# EAGLE design BBiQ-1.0 (EAGLE 9.1.1)
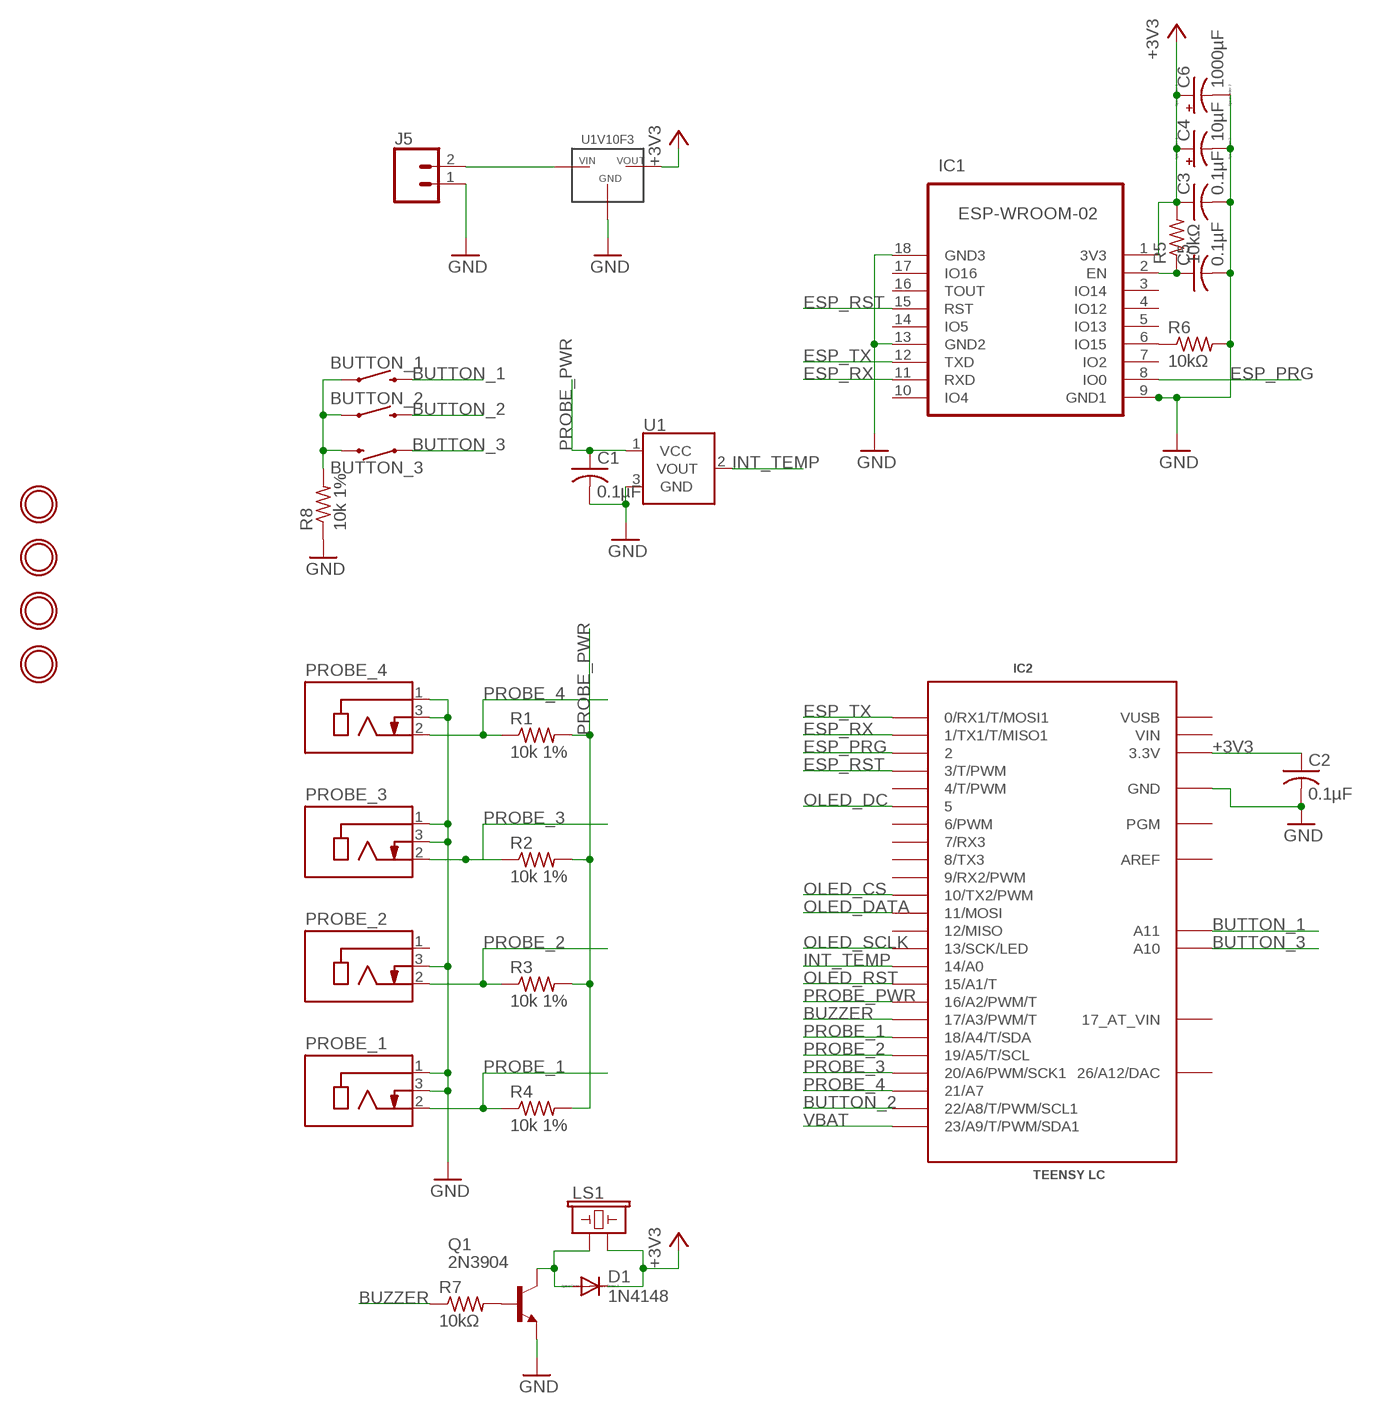
[diagram p0: schematic, sheet 1]

## Parts
BUTTON_1  MOMENTARY-SWITCH-SPST-PTH-6.0MM  [TACTILE_SWITCH_PTH_6.0MM]
BUTTON_2  MOMENTARY-SWITCH-SPST-PTH-6.0MM  [TACTILE_SWITCH_PTH_6.0MM]
BUTTON_3  MOMENTARY-SWITCH-SPST-PTH-6.0MM  [TACTILE_SWITCH_PTH_6.0MM]
C1  0.1µF  C-US025-025X050  [C025-025X050]
C2  0.1µF  C-US025-025X050  [C025-025X050]
C3  0.1µF  C-US025-025X050  [C025-025X050]
C4  10µF  CPOL-USE2-5  [E2-5]
C5  0.1µF  C-US025-025X050  [C025-025X050]
C6  1000µF  CPOL-USE3.5-8  [E3,5-8]
D1  1N4148  1N4148DO35-7  [DO35-7]
IC1  ESP-WROOM-02  [ESP-WROOM-02]
IC2  TEENSY LC  TEENSY_LC_ALL_PINS  [TEENSY_3.0-3.2&LC_ALL_PINS]
J5  CONN_02JST-PTH-2  [JST-2-PTH]
LS1  BUZZER-PTH  [BUZZER-12MM]
PROBE_1  MJ-2506N  [CUI_MJ-2506N]
PROBE_2  MJ-2506N  [CUI_MJ-2506N]
PROBE_3  MJ-2506N  [CUI_MJ-2506N]
PROBE_4  MJ-2506N  [CUI_MJ-2506N]
Q1  2N3904  [TO92]
R1  10k 1%  R-US_0207/7  [0207/7]
R2  10k 1%  R-US_0207/7  [0207/7]
R3  10k 1%  R-US_0207/7  [0207/7]
R4  10k 1%  R-US_0207/7  [0207/7]
R5  10kΩ  R-US_0207/7  [0207/7]
R6  10kΩ  R-US_0207/7  [0207/7]
R7  10kΩ  R-US_0207/7  [0207/7]
R8  10k 1%  R-US_0207/7  [0207/7]
U1  TMP36GT9  [TO-92]
U$2  U1V10F3  [U1V10F3]
U$3  MOUNTINGHOLE2.5  [MOUNTINGHOLE_2.5_PLATED]
U$4  MOUNTINGHOLE2.5  [MOUNTINGHOLE_2.5_PLATED]
U$5  MOUNTINGHOLE2.5  [MOUNTINGHOLE_2.5_PLATED]
U$6  MOUNTINGHOLE2.5  [MOUNTINGHOLE_2.5_PLATED]

## Nets
+3V3: C2.1 C3.1 C4.+ C6.+ D1.C IC1.1(3V3) IC2.3.3V IC2.3.3V1(3.3V) LS1.- R5.2 U$2.VOUT
BUTTON_1: BUTTON_1.3 IC2.A11
BUTTON_2: BUTTON_2.3 IC2.22/A8(22/A8/T/PWM/SCL1)
BUTTON_3: BUTTON_3.1 IC2.A10
BUZZER: IC2.17/A3(17/A3/PWM/T) R7.1
ESP_EN: C5.1 IC1.2(EN) R5.1
ESP_PRG: IC1.8(IO0) IC2.2
ESP_RST: IC1.15(RST) IC2.3(3/T/PWM)
ESP_RX: IC1.11(RXD) IC2.1(1/TX1/T/MISO1)
ESP_TX: IC1.12(TXD) IC2.0(0/RX1/T/MOSI1)
GND: C1.2 C2.2 C3.2 C4.- C5.2 C6.- IC1.9(GND1) IC1.13(GND2) IC1.18(GND3) IC1.19(GND0) IC2.AGND(GND) IC2.GND IC2.GND1(GND) J5.1 PROBE_1.1 PROBE_1.3 PROBE_2.3 PROBE_3.1 PROBE_3.3 PROBE_4.1 PROBE_4.3 Q1.3(E) R6.2 R8.1 U1.3(GND) U$2.GND
INT_TEMP: IC2.14/A0 U1.2(VOUT)
N$1: IC1.6(IO15) R6.1
N$2: Q1.2(B) R7.2
N$3: D1.A LS1.+ Q1.1(C)
N$4: BUTTON_1.1 BUTTON_2.1 BUTTON_3.3 R8.2
OLED_CS: IC2.10(10/TX2/PWM)
OLED_DATA: IC2.11(11/MOSI)
OLED_DC: IC2.5
OLED_RST: IC2.15/A1(15/A1/T)
OLED_SCLK: IC2.13(13/SCK/LED)
PROBE_1: IC2.18/A4(18/A4/T/SDA) PROBE_1.2 R4.1
PROBE_2: IC2.19/A5(19/A5/T/SCL) PROBE_2.2 R3.1
PROBE_3: IC2.20/A6(20/A6/PWM/SCK1) PROBE_3.2 R2.1
PROBE_4: IC2.21/A7 PROBE_4.2 R1.1
PROBE_PWR: C1.1 IC2.16/A2(16/A2/PWM/T) R1.2 R2.2 R3.2 R4.2 U1.1(VCC)
VBAT: IC2.23/A9(23/A9/T/PWM/SDA1) J5.2 U$2.VIN
Unconnected: IC1.3(IO14) IC1.4(IO12) IC1.5(IO13) IC1.7(IO2) IC1.10(IO4) IC1.14(IO5) IC1.16(TOUT) IC1.17(IO16) IC2.4(4/T/PWM) IC2.6(6/PWM) IC2.7(7/RX3) IC2.8(8/TX3) IC2.9(9/RX2/PWM) IC2.12(12/MISO) IC2.PGM IC2.VBAT(17_AT_VIN) PROBE_2.1

## Power pins joined to a net without a drawn wire
26/A12/DAC: IC2.RESET/DAC(26/A12/DAC)
AREF: IC2.AREF
VIN: IC2.VIN
VUSB: IC2.VUSB

## Library data of the parts
BUTTON_1-BUTTON_3 = SparkFun-Switches:MOMENTARY-SWITCH-SPST: Momentary Switch (Pushbutton) - SPST Normally-open (NO) SPST momentary switches (buttons, pushbuttons). Variants PTH-12MM - 12mm square, through-hole Momentary Pushbutton Switch - 12mm Square <https://www.sparkfun.com/products/9190> (COM-09190) PTH-6.0MM, PTH-6.0MM-KIT - 6.0mm square, through-hole Mini Pushbutton Switch <https://www.sparkfun.com/products/97> (COM-00097) KIT package intended for soldering kit's - only one side of pads' copper is exposed. PTH-RIGHT-ANGLE-KIT - Right-angle, through-hole Right Angle Tactile Button <https://www.sparkfun.com/products/10791> - Used on SparkFun BigTime Watch Kit <https://www.sparkfun.com/products/11734> SMD-12MM - 12mm square, surface-mount Tactile Button - SMD (12mm) <https://www.sparkfun.com/products/12993> (COM-12993) Used on SparkFun PicoBoard <https://www.sparkfun.com/products/11888> SMD-4.5MM - 4.5mm Square Trackball Switch Used on SparkFun Blackberry Trackballer Breakout <https://www.sparkfun.com/products/13169> SMD-4.6MMX2.8MM - 4.60mm x 2.80mm, surface mount Used on SparkFun SAMD21 Mini Breakout <https://www.sparkfun.com/products/13664> SMD-5.2MM, SMD-5.2-REDUNDANT - 5.2mm square, surface-mount Mini Pushbutton Switch - SMD <https://www.sparkfun.com/products/8720> (COM-08720) Used on Arduino Pro Mini <https://www.sparkfun.com/products/11114> REDUNDANT package connects both switch circuits together SMD-6.0X3.5MM - 6.0 x 3.5mm, surface mount Momentary Reset Switch SMD <https://www.sparkfun.com/products/8229> (COM-08229) SMD-6.2MM-TALL - 6.2mm square, surface mount Tactile Button - SMD (6mm) <https://www.sparkfun.com/products/12992> Used on SparkFun Digital Sandbox <https://www.sparkfun.com/products/12651> SMD-RIGHT-ANGLE - Right-angle, surface mount Used on SparkFun Block for Intel® Edison - Arduino <https://www.sparkfun.com/products/13036>; PROD_ID: SWCH-08441; SF_SKU: COM-00097
C1-C3 C5 = resistor:C-US: CAPACITOR, American symbol
C4 C6 = resistor:CPOL-US: POLARIZED CAPACITOR, American symbol
D1 = diode:1N4148: DIODE high speed (Philips)
IC1 = esp-wroom-02:ESP-WROOM-02: WiFi module - ESP-WROOM-02
IC2 = Teensy_3_and_LC_Series_Boards_v1.4:TEENSY_LC_ALL_PINS: Teensy LC board with all pins used.
J5 = SparkFun-Connectors:CONN_02: Multi connection point. Often used as Generic Header-pin footprint for 0.1 inch spaced/style header connections On any of the 0.1 inch spaced packages, you can populate with these: Break Away Headers - Straight <https://www.sparkfun.com/products/116> (PRT-00116) Break Away Male Headers - Right Angle <https://www.sparkfun.com/products/553> (PRT-00553) Female Headers <https://www.sparkfun.com/products/115> (PRT-00115) Break Away Headers - Machine Pin <https://www.sparkfun.com/products/117> (PRT-00117) Break Away Female Headers - Swiss Machine Pin <https://www.sparkfun.com/products/743> (PRT-00743) For SCREWTERMINALS and SPRING TERMINALS visit here: Screw Terimnals on SparkFun.com <https://www.sparkfun.com/search/results?term=Screw+Terminals> (5mm/3.5mm/2.54mm spacing) This device is also useful as a general connection point to wire up your design to another part of your project. Our various solder wires solder well into these plated through hole pads. Hook-Up Wire - Assortment (Stranded, 22 AWG) <https://www.sparkfun.com/products/11375> (PRT-11375) Hook-Up Wire - Assortment (Solid Core, 22 AWG) <https://www.sparkfun.com/products/11367> (PRT-11367) View the entire wire category on our website here <https://www.sparkfun.com/categories/141> Special notes: Molex polarized connector foot print use with: PRT-08233 with associated crimp pins and housings. 2.54_SCREWTERM for use with PRT-10571. 3.5mm Screw Terminal footprints for PRT-08084 5mm Screw Terminal footprints for use with PRT-08432; PROD_ID: CONN-09863; SKU: PRT-09914
LS1 = SparkFun-Electromechanical:BUZZER: Buzzer Small round buzzers that operate around the audible 2kHz range. You can use these as speakers to create simple music or user interfaces. Variant Overview: PTH - Mini Speaker - PC Mount 12mm 2.048kHz <https://www.sparkfun.com/products/7950> PTH_KIT - Mini Speaker - PC Mount 12mm 2.048kHz <https://www.sparkfun.com/products/7950> KIT simplifies soldering by adding stop mask to one side of the pads. PTH_NO_SILK - Mini Speaker - PC Mount 12mm 2.048kHz <https://www.sparkfun.com/products/7950> No silkscreen indicator of buzzer outline. PTH_KIT_NO_SILK - Mini Speaker - PC Mount 12mm 2.048kHz <https://www.sparkfun.com/products/7950> KIT package w/o silkscreen SMD - Buzzer Audio Magnetic (CCV-084B16) SMD buzzer used on, e.g. the LilyPad Buzzer <https://www.sparkfun.com/products/8463> and RFID USB Reader <https://www.sparkfun.com/products/9963>. SMD_KIT - Buzzer Audio Magnetic (CCV-084B16) SMD Buzzer with elongated pins to make soldering easier. Used on the SparkFun Simon Says - Surface Mount Soldering Kit <https://www.sparkfun.com/products/10935>.; PROD_ID: COMP-08253; SF_SKU: COM-07950
PROBE_1-PROBE_4 = MJ-2506N:MJ-2506N: 2.5 mm, Mono, Right Angle, Through Hole, Audio Jack Connector; MANUFACTURER: CUI INC; PART_REV: E; STANDARD: MANUFACTURER RECOMMENDATIONS
Q1 = transistor:2N3904: NPN TRANSISTOR
R1-R8 = resistor:R-US_: RESISTOR, American symbol
U1 = SparkFun-Sensors:TMP36: TMP36 Precision Analog °C Temperature Sensor The TMP36 is a low voltage, precision centigrade temperature sensor. It provides a voltage output that is linearly proportional to the Celsius temperature. It also doesn’t require any external calibration to provide typical accuracies of ±1°C at +25°C and ±2°C over the −40°C to +125°C temperature range. We like it because it’s so easy to use: Just give the device a ground and 2.7 to 5.5 VDC and read the voltage on the Vout pin. The output voltage can be converted to temperature easily using the scale factor of 10 mV/°C. Datasheet <http://cdn.sparkfun.com/datasheets/Sensors/Temp/TMP35_36_37.pdf> SparkFun Products Temperature Sensor - TMP36 <https://www.sparkfun.com/products/10988> (SEN-10988) SparkFun Danger Shield <https://www.sparkfun.com/products/11649> (DEV-11649); PROD_ID: IC-09880; SF_ID: SEN-10988
U$2 = U1V10F3:U1V10F3: U1V10F3 3.3 Volt Spannungsregler-Board Pololu
U$3-U$6 = microbuilder:MOUNTINGHOLE: Mounting Hole For #2 screws (0.086"/2.18mm width, 0.094"/2.4mm hole) use 2.5mm

## Board
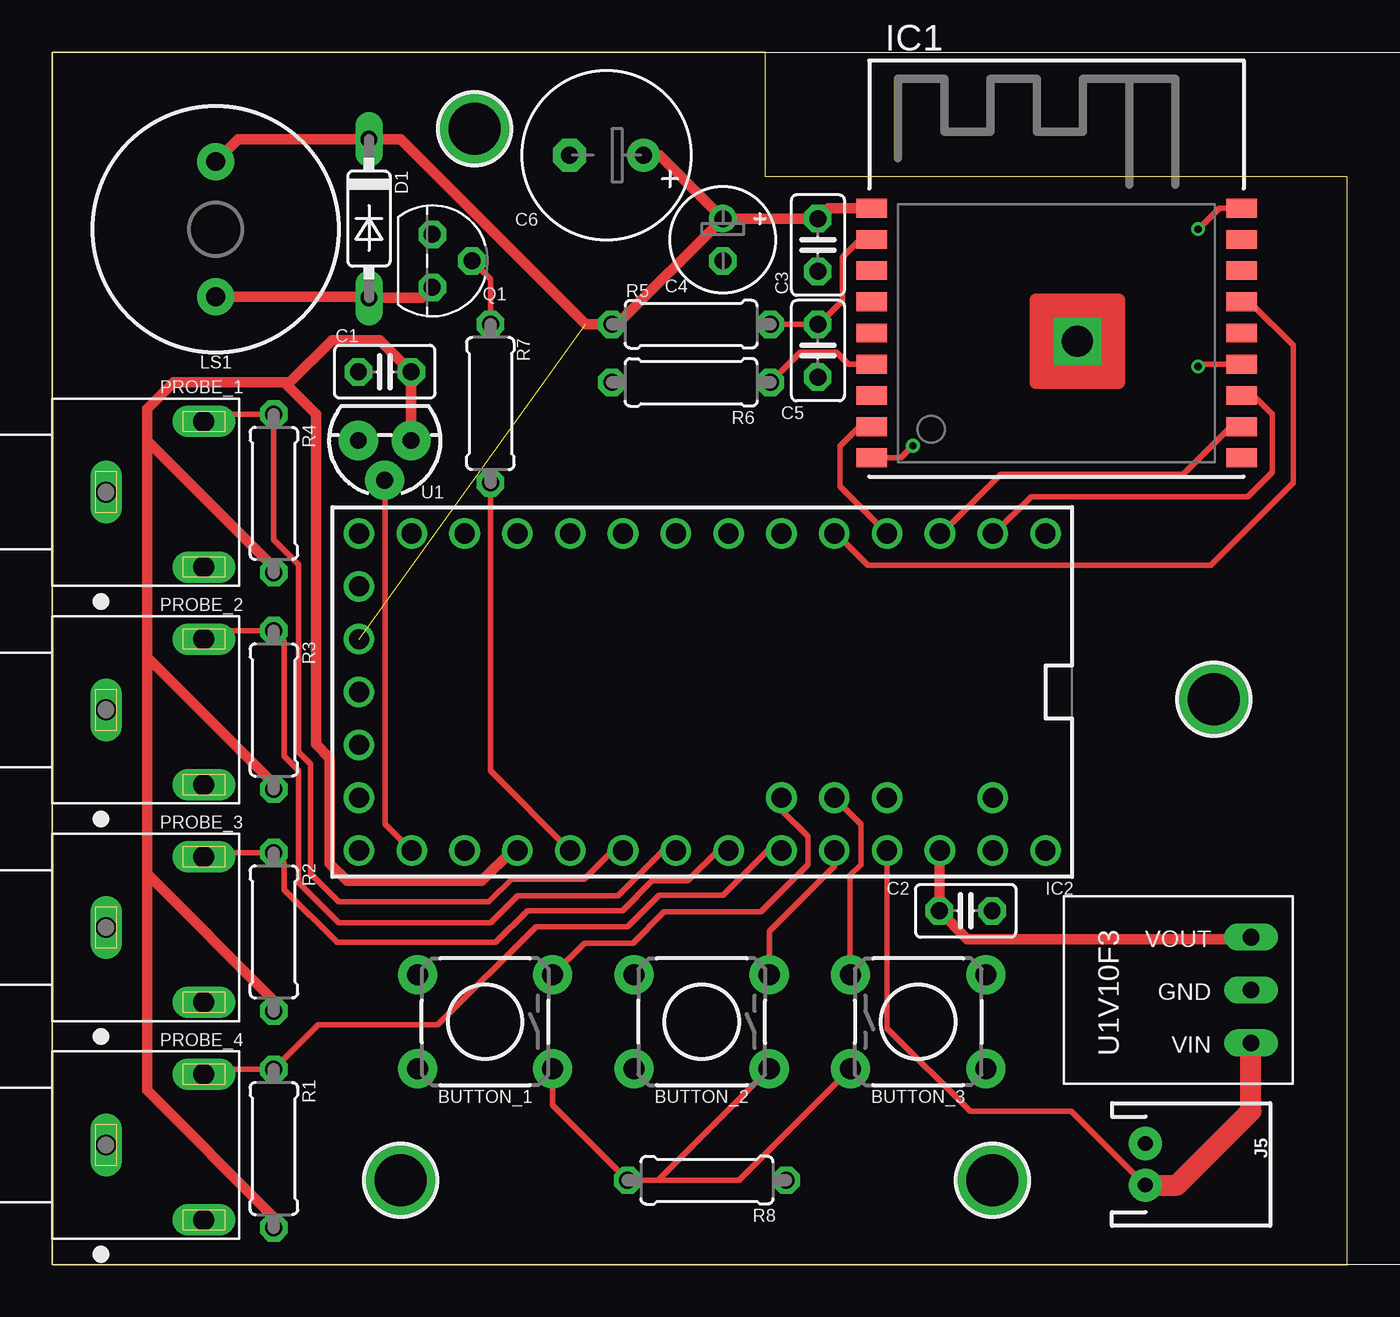
[diagram p1: board, top side]
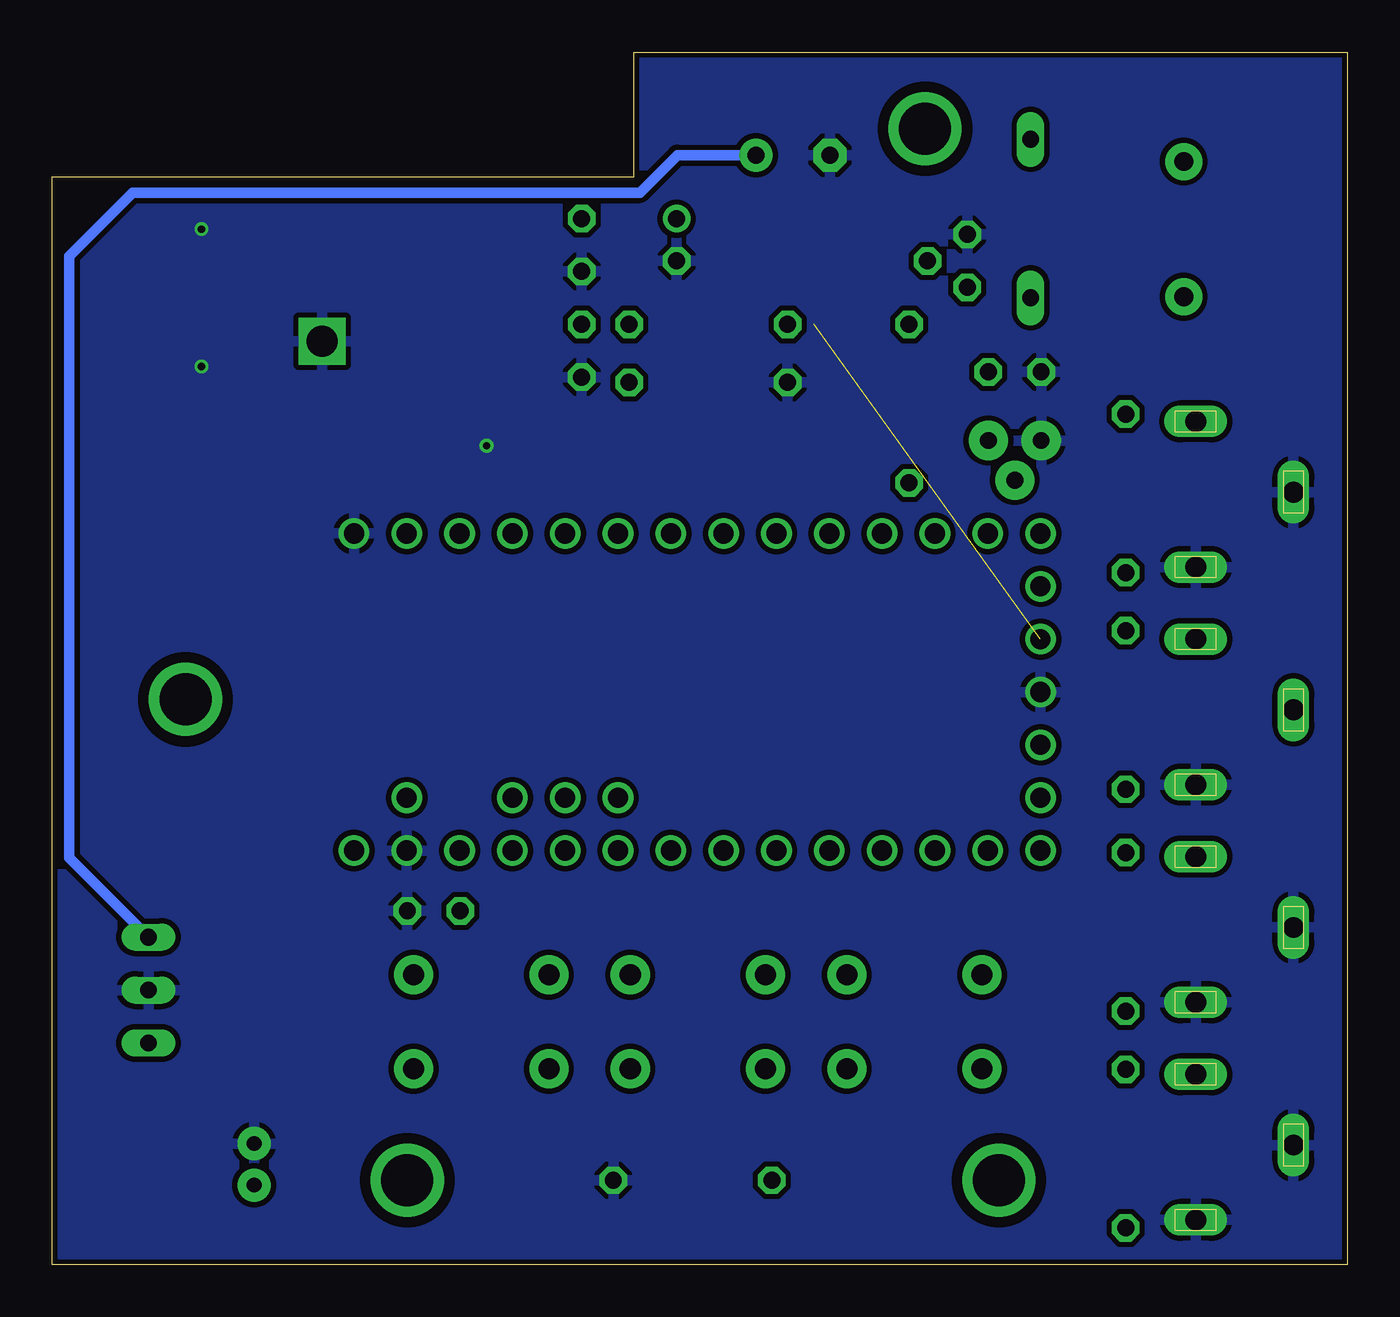
[diagram p2: board, bottom side, seen from below]

Size 62.3 x 58.3 mm. Coordinates in mm from the lower left corner, seen from the top.
Outline: 0,0 62.3,0 62.3,52.3 34.3,52.3 34.3,58.3 0,58.3 0,0
Copper layers (1*16): Top 0.035mm / dielectric 1.5mm / Bottom 0.035mm
Design rules "SeeedStudio_2layer_DRU_no_angle_20140221": minimum track width 6mil, minimum drill 12mil, track to track 6mil, track to pad 6mil, pad to pad 6mil, via to via 6mil, smd to smd 0mil, copper to edge 10mil, drill to drill 10mil, minimum pad ring 10mil, minimum via ring 6mil, stop-mask expansion 2mil, vias tented up to drill 100mil, thermal gap 10mil

### Footprints (pad centres in the part's own frame; a part is rotated, then mirrored left to right if it is on the bottom)
TACTILE_SWITCH_PTH_6.0MM = drill 1.016 pad 1.88: 1 -3.251,2.261; 2 3.251,2.261; 3 -3.251,-2.261; 4 3.251,-2.261
C025-025X050 = drill 0.813 octagon: 1 -1.27,0; 2 1.27,0
E2-5 = drill 0.813 pad 1.27: + -1.016,0 | drill 0.813 pad 1.27 octagon: - 1.016,0
E3,5-8 = drill 0.813 pad 1.6: + -1.778,0 | drill 0.813 pad 1.6 octagon: - 1.778,0
DO35-7 = drill 0.813 long: A 3.81,0; C -3.81,0
ESP-WROOM-02 = smd 1.485 x 0.9: 1 -8.893,4.9; 2 -8.893,3.4; 3 -8.893,1.9; 4 -8.893,0.4; 5 -8.893,-1.1; 6 -8.893,-2.6; 7 -8.893,-4.1; 8 -8.893,-5.6; 9 -8.893,-7.1; 10 8.893,-7.1; 11 8.893,-5.6; 12 8.893,-4.1; 13 8.893,-2.6; 14 8.893,-1.1; 15 8.893,0.4; 16 8.893,1.9; 17 8.893,3.4; 18 8.893,4.9 | drill 1.5 pad 2 square: 19 1,-1.5
TEENSY_3.0-3.2&LC_ALL_PINS = drill 0.965: 0 -7.62,13.97; 1 -7.62,11.43; 2 -7.62,8.89; 3 -7.62,6.35; 3.3V 7.62,11.43; 3.3V1 -2.54,-16.51; 4 -7.62,3.81; 5 -7.62,1.27; 6 -7.62,-1.27; 7 -7.62,-3.81; 8 -7.62,-6.35; 9 -7.62,-8.89; 10 -7.62,-11.43; 11 -7.62,-13.97; 12 -7.62,-16.51; 13 7.62,-16.51; 14/A0 7.62,-13.97; 15/A1 7.62,-11.43; 16/A2 7.62,-8.89; 17/A3 7.62,-6.35; 18/A4 7.62,-3.81; 19/A5 7.62,-1.27; 20/A6 7.62,1.27; 21/A7 7.62,3.81; 22/A8 7.62,6.35; 23/A9 7.62,8.89; A10 5.08,6.35; A11 5.08,3.81; AGND 7.62,13.97; AREF 5.08,8.89; GND -7.62,16.51; GND1 0,-16.51; PGM 2.54,-16.51; RESET/DAC 5.08,-16.51; VBAT -5.08,-16.51; VIN 7.62,16.51; VUSB 5.08,13.97
JST-2-PTH = drill 0.7 pad 1.6: 1 -1,0; 2 1,0
BUZZER-12MM = drill 0.9 pad 1.778: + 3.25,0; - -3.25,0
CUI_MJ-2506N = drill 1 long: 1 -2.4,0; 2 2.3,3.4; 3 2.3,-3.6
TO92 = drill 0.813 octagon: 1 1.27,0; 2 0,1.905; 3 -1.27,0
0207/7 = drill 0.813 octagon: 1 -3.81,0; 2 3.81,0
TO-92 = drill 0.813 pad 1.88: 1 -1.27,0; 2 0,1.905; 3 1.27,0
U1V10F3 = drill 0.8 long: GND 0,0; VIN -2.54,0; VOUT 2.54,0
MOUNTINGHOLE_2.5_PLATED = drill 2.5 pad 3.2: P$1 0,0

### Placement (x,y rotation side)
BUTTON_1  20.83,11.68 180 top
BUTTON_2  31.24,11.68 180 top
BUTTON_3  41.66,11.68 0 top
C1  16,42.93 180 top
C2  43.94,17.02 0 top
C3  36.83,49.02 270 top
C4  32.26,49.28 270 top
C5  36.83,43.94 270 top
C6  26.67,53.34 180 top
D1  15.24,50.29 270 top
IC1  48.31,45.89 0 top
IC2  31.27,27.53 270 top
J5  52.58,4.83 270 top
LS1  7.87,49.78 270 top
PROBE_1  5,37.14 0 top
PROBE_2  5,26.68 0 top
PROBE_3  5,16.22 0 top
PROBE_4  5,5.75 0 top
Q1  18.29,48.26 270 top
R1  10.67,5.59 270 top
R2  10.67,16 270 top
R3  10.67,26.67 270 top
R4  10.67,37.08 270 top
R5  30.73,45.21 180 top
R6  30.73,42.42 180 top
R7  21.08,41.4 90 top
R8  31.5,4.06 180 top
U1  16,39.62 180 top
U$2  57.66,13.21 90 top
U$3  55.88,27.18 0 top
U$4  45.21,4.06 0 top
U$5  16.76,4.06 0 top
U$6  20.32,54.61 0 top

### Tracks (layer width: path | path; a pad name or v marks a point on that pad's centre or on a via)
+3V3  (1 unrouted)
  Top 0.508: IC2.3.3V 42.67,19.89 C2.1 44.03,15.66 57.57,15.66 U$2.VOUT | IC1.1 37.33,50.79 C3.1 C4.+ | LS1.- 8.94,54.1 D1.C 16.76,54.1 25.65,45.21 26.67,45.21 R5.2 27.18,45.21 C4.+ | C4.+ 29.21,53.34 C6.+
  Bottom 0.508: U$2.VOUT 61.47,19.56 61.47,48.49 58.42,51.54 34.03,51.54 32.23,53.34 C6.+
BUTTON_1
  Top 0.254: IC2.A11 35.08,21.86 36.35,20.59 36.35,19.24 34.08,16.97 29.44,16.97 27.94,15.47 25.6,15.47 BUTTON_1.3
BUTTON_2
  Top 0.254: BUTTON_2.3 34.49,16.02 37.62,19.15 IC2.22/A8
BUTTON_3
  Top 0.254: BUTTON_3.1 38.38,13.97 38.38,18.73 38.89,19.24 38.89,21.18 IC2.A10
BUZZER
  Top 0.254: IC2.17/A3 21.08,23.75 R7.1
ESP_EN
  Top 0.254: R5.1 C5.1 36.89,45.21 38.02,46.35 38.02,48.44 38.86,49.28 39.4,49.28 IC1.2
ESP_PRG
  Top 0.254: IC2.2 37.89,37.43 37.89,39.36 38.82,40.29 IC1.8
ESP_RST
  Top 0.254: IC2.3 37.71,35.15 39.23,33.63 55.73,33.63 59.69,37.59 59.69,44.2 57.66,46.23 57.26,46.23 IC1.15
ESP_RX
  Top 0.152: 56.69,40.29 56.9,40.29 IC1.11
  Top 0.254: IC2.1 42.79,35.15 45.64,38 54.41,38 56.69,40.29
ESP_TX
  Top 0.152: 57.71,41.79 IC1.12
  Top 0.254: IC2.0 45.33,35.15 47.1,36.93 57.51,36.93 58.67,38.1 58.67,40.89 57.78,41.79 57.71,41.79
GND  (via drill 0.35)
  Top 0.254: IC1.9 40.82,38.79 v41.4,39.37 | IC1.18 56.12,50.79 v55.12,49.78 | IC1.13 55.23,43.29 v55.12,43.18
  pour Bottom (isolate 0.254): 0,0 0,58.3 34.3,58.3 34.3,52.3 62.3,52.3 62.3,0
INT_TEMP
  Top 0.254: IC2.14/A0 16.03,21.18 16.03,37.69 U1.2
N$1
  Top 0.254: IC1.6 38.3,43.29 37.73,43.87 35.99,43.87 R6.1
N$2
  Top 0.254: R7.2 21.08,47.37 Q1.2
N$3
  Top 0.508: LS1.+ 15.19,46.53 D1.A 17.78,46.48 Q1.1
N$4
  Top 0.254: BUTTON_3.3 33.05,4.06 R8.2 | BUTTON_2.1 29.13,4.06 R8.2 | BUTTON_1.1 24.08,7.67 R8.2
PROBE_1
  Top 0.254: PROBE_1.2 7.65,40.89 R4.1 10.67,34.86 11.86,33.66 11.86,24.64 12.45,24.05 12.45,18.8 13.79,17.45 21.01,17.45 22.1,18.54 25.58,18.54 26.95,19.91 IC2.18/A4
PROBE_2
  Top 0.254: PROBE_2.2 7.7,30.48 R3.1 11.18,29.97 11.18,24.44 11.86,23.76 11.86,18.36 13.79,16.43 21.08,16.43 22.39,17.74 27.22,17.74 29.39,19.91 IC2.19/A5
PROBE_3
  Top 0.254: PROBE_3.2 7.5,19.81 R2.1 11.18,19.3 11.18,18.03 13.72,15.49 21.34,15.49 22.86,17.02 27.43,17.02 28.87,18.45 30.57,18.45 32.03,19.91 IC2.20/A6
PROBE_4
  Top 0.254: PROBE_4.2 7.54,9.4 R1.1 12.8,11.53 18.54,11.53 23.27,16.26 27.69,16.26 29.2,17.77 32.27,17.77 34.41,19.91 IC2.21/A7
PROBE_PWR
  Top 0.508: R1.2 10.67,2.29 4.57,8.38 4.57,18.8 | 4.57,18.8 4.57,29.46 | 4.57,29.46 4.57,40.39 | 4.57,40.39 4.57,41.15 5.84,42.42 11.18,42.42 | 4.57,18.8 10.67,12.7 R2.2 | 4.57,29.46 4.57,29.21 10.67,23.11 R3.2 | 4.57,40.39 4.57,39.62 10.67,33.53 R4.2 | 11.18,42.42 11.43,42.42 13.46,44.45 15.75,44.45 C1.1 U1.1 | 11.18,42.42 12.7,40.89 12.7,25.02 13.36,24.36 13.36,19.28 14.19,18.45 20.66,18.45 22.13,19.91 IC2.16/A2
VBAT
  Top 0.254: IC2.23/A9 40.16,11.38 44.15,7.38 49.02,7.38 J5.2
  Top 1.016: U$2.VIN 57.66,7.38 54.1,3.83 J5.2